# EAGLE design ServoController (EAGLE 7.6.0)
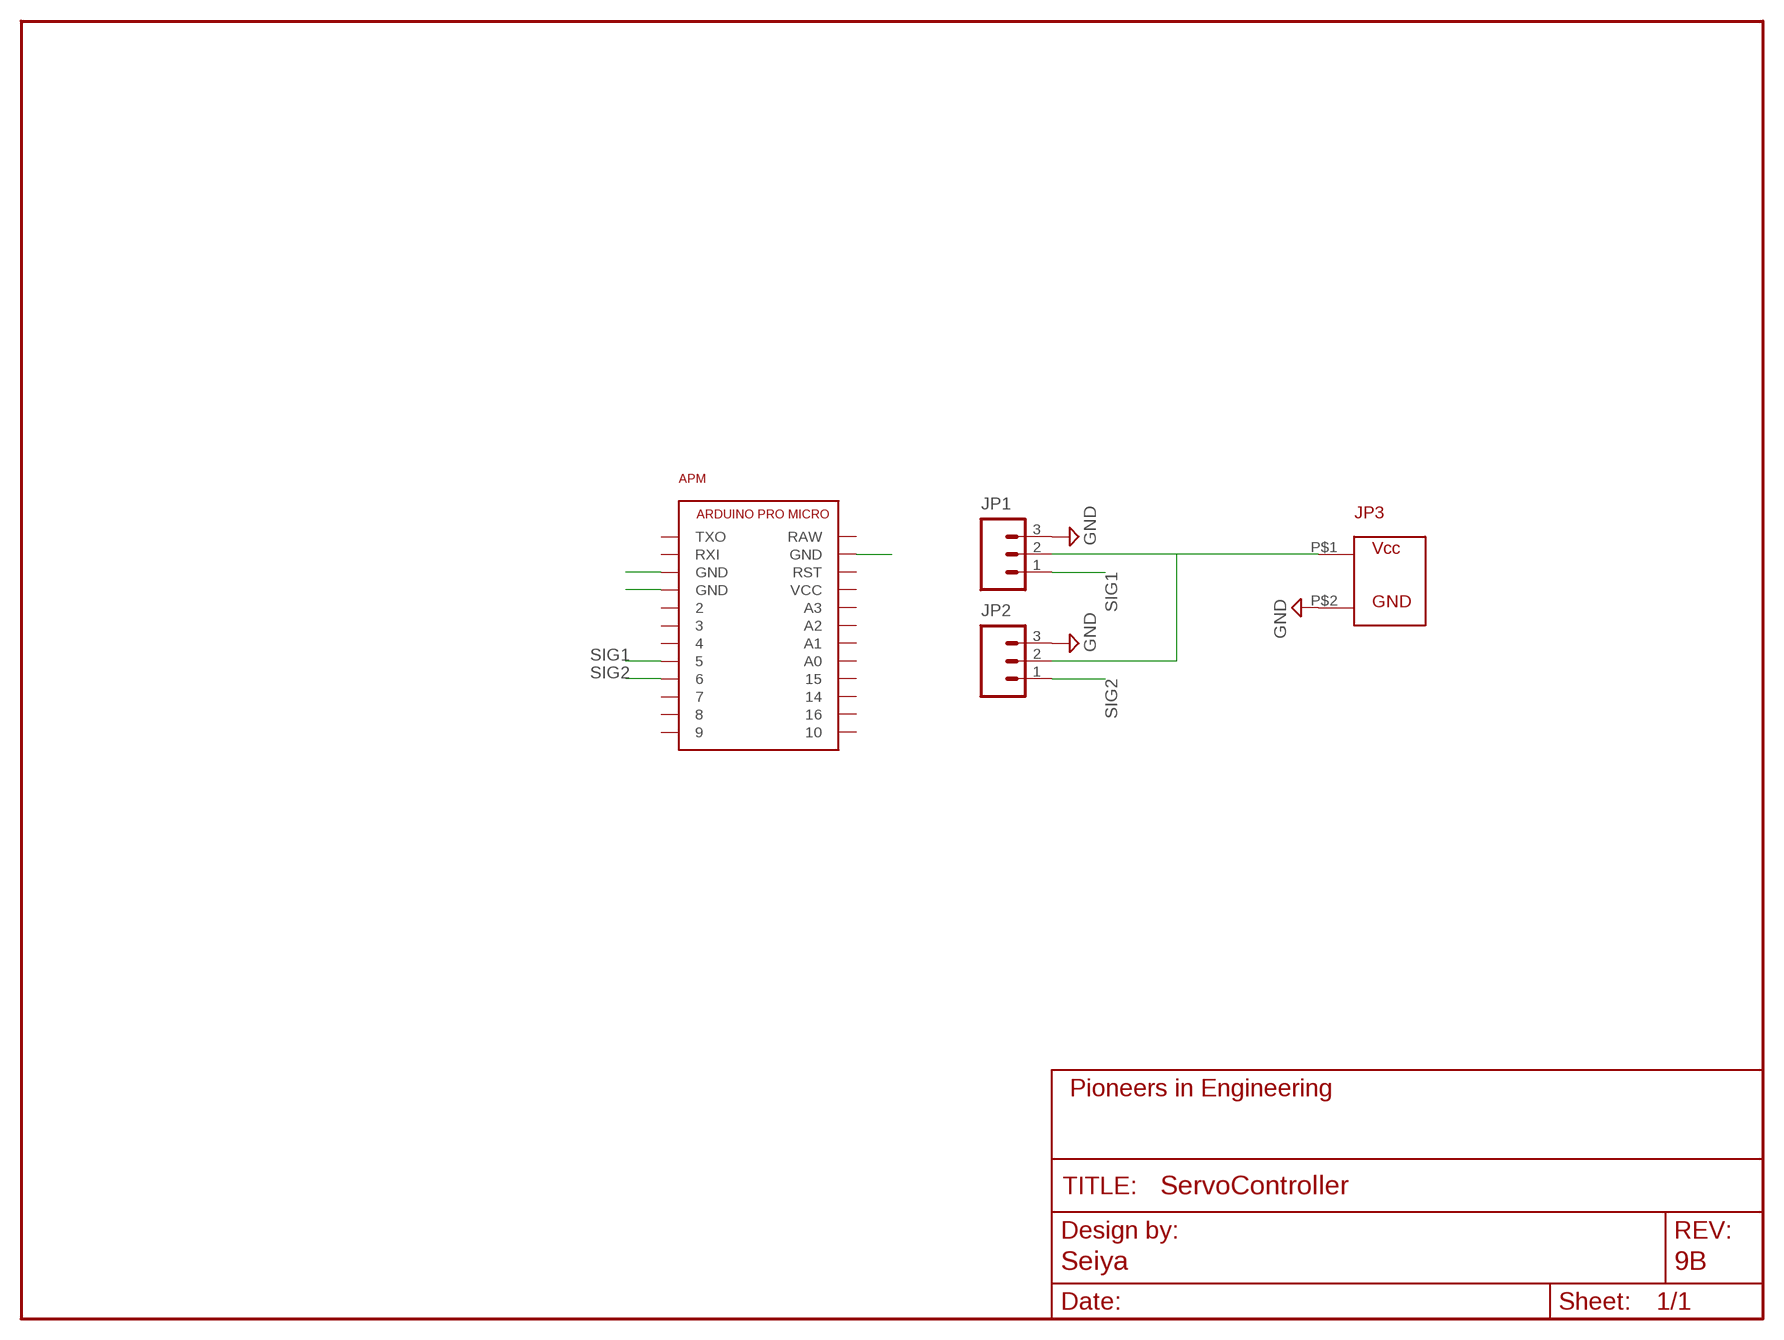
[diagram p0: schematic, sheet 1]
FRAME1 (FRAME_SCHEMATIC): AUTHOR: Seiya; REVISION: 9B

## Parts
APM  ARDUINO_PRO_MICRO  [ARDUINO_PRO_MICRO]
JP1  M031X03-MTA  [1X03-MTA]
JP2  M031X03-MTA  [1X03-MTA]
JP3  ATX  [ATX]

## Nets
GND: APM.GND@0(GND) APM.GND@1(GND) APM.GND@2(GND) JP1.3 JP2.3 JP3.P$2
SIG1: APM.5 JP1.1
SIG2: APM.6 JP2.1
VCC: JP1.2 JP2.2 JP3.P$1
Unconnected: APM.2 APM.3 APM.4 APM.7 APM.8 APM.9 APM.10 APM.14 APM.15 APM.16 APM.A0 APM.A1 APM.A2 APM.A3 APM.RAW APM.RST APM.RXI APM.TXO APM.VCC

## Library data of the parts
APM = pie:ARDUINO_PRO_MICRO: Arduino Pro Micro Electrical System Year 9's Smart Sensor Core Pin Outs <https://cdn.sparkfun.com/assets/9/c/3/c/4/523a1765757b7f5c6e8b4567.png> Buy Here <http://www.aliexpress.com/item/Mini-Leonardo-Pro-Micro-ATmega32U4-5V-16MHz-Module-For-Arduino-Best-Quality/32284746884.html?ws_ab_test=searchweb201556_8,searchweb201602_2_10057_10056_10065_10055_10054_10067_10069_10059_10058_10017_10070_10060_10061_10052_10062_10053_10050_10051,searchweb201603_1&btsid=45993952-29ca-4de4-a0fb-c7fb72b8e1a5>
JP1 JP2 = pie:M03: 3-pin 0.1-inch header and MTA connector; PIE-INT-REF-NUM: MTA
JP3 = pie:ATX: ATX 2 Pin Connector Crimper: http://www.digikey.com/product-detail/en/molex-llc/0640160204/WM17553-ND/2074099 Housing: http://www.digikey.com/product-detail/en/molex-llc/0019092029/WM4382-ND/2421313 Housing (alternative): http://www.digikey.com/product-detail/en/molex-llc/0015311026/WM1041-ND/313614 Connector: http://www.digikey.com/product-detail/en/molex-llc/0019091029/WM1602-ND/26354 Male crimps: http://www.digikey.com/product-detail/en/molex-llc/0002092103/WM1100-ND/26384 Female crimps: http://www.digikey.com/product-detail/en/molex-llc/0002091104/WM1101-ND/26386

## Board
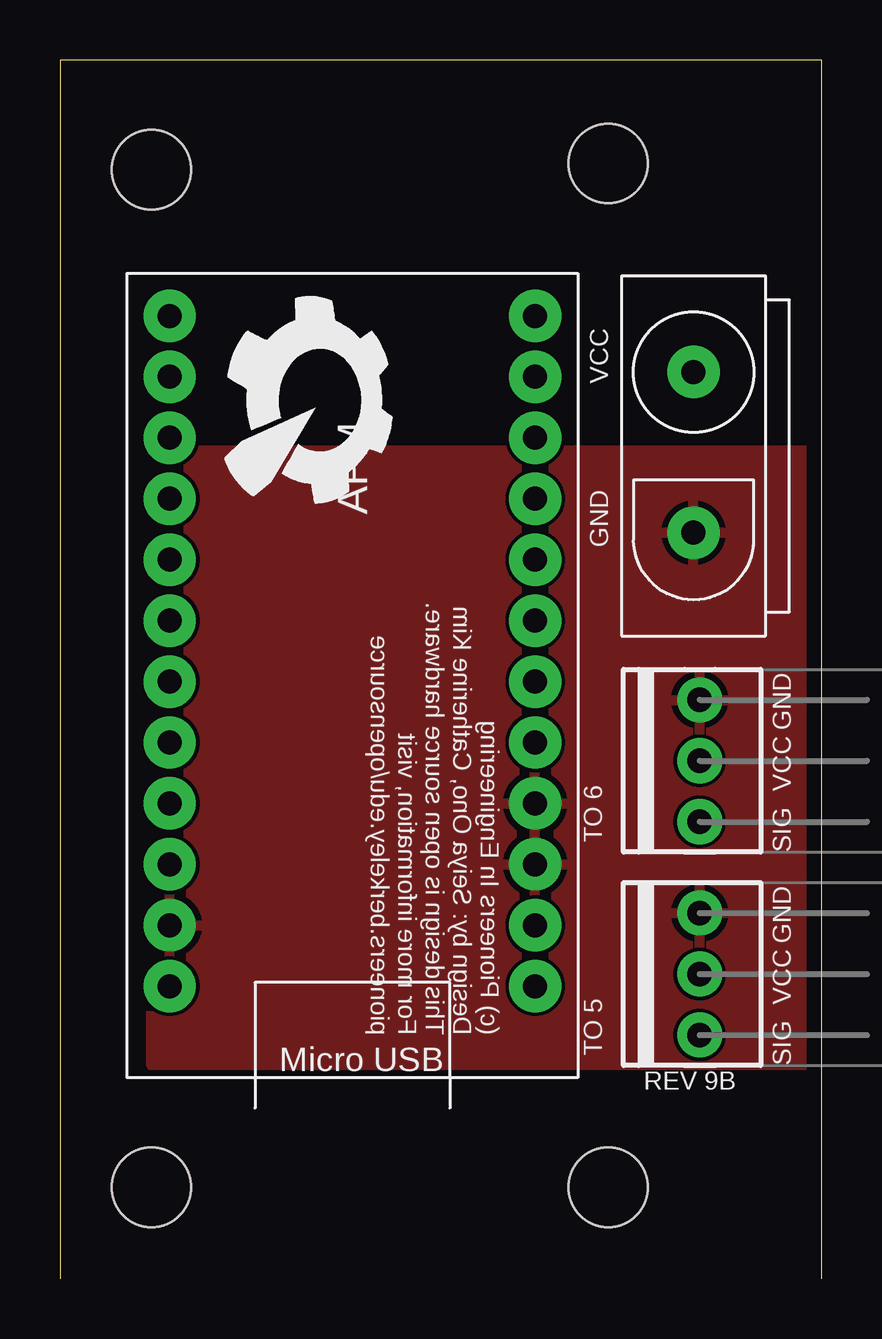
[diagram p1: board, top side]
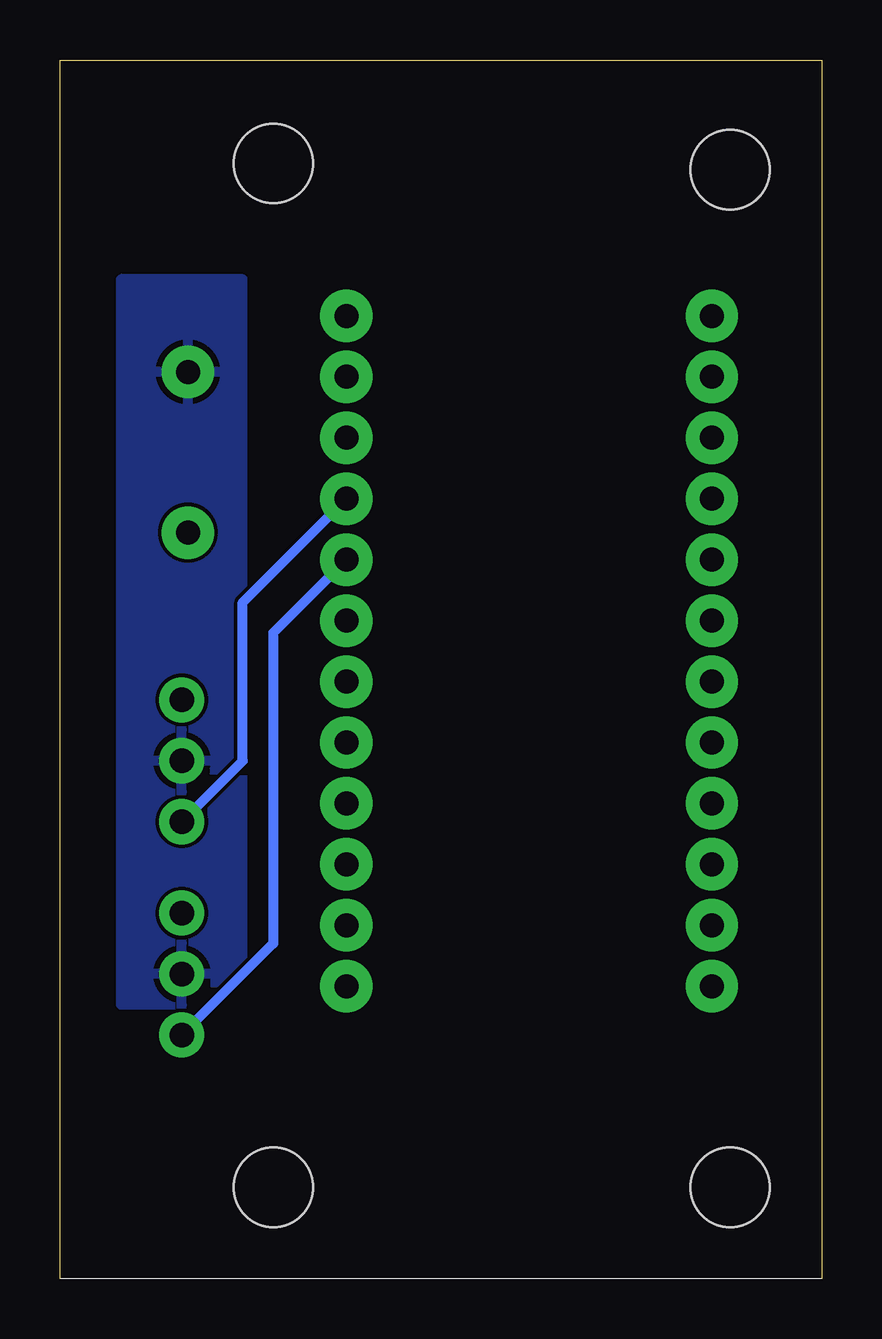
[diagram p2: board, bottom side, seen from below]

Size 31.75 x 50.8 mm. Coordinates in mm from the lower left corner, seen from the top.
Outline: 31.75,0 31.75,50.8 0,50.8 0,0
Copper layers (1*16): Top 2mil / dielectric 9mil / Bottom 2mil
Design rules "pie": minimum track width 6mil, minimum drill 15mil, track to track 6mil, track to pad 6mil, pad to pad 6mil, via to via 6mil, smd to smd 6mil, copper to edge 25mil, drill to drill 7mil, minimum pad ring 7mil, minimum via ring 7mil, stop-mask expansion 3mil, vias tented up to drill 21mil, thermal gap 10mil

### Footprints (pad centres in the part's own frame; a part is rotated, then mirrored left to right if it is on the bottom)
ARDUINO_PRO_MICRO = drill 1 pad 2.184: 2 1.778,19.558; 3 1.778,17.018; 4 1.778,14.478; 5 1.778,11.938; 6 1.778,9.398; 7 1.778,6.858; 8 1.778,4.318; 9 1.778,1.778; 10 17.018,1.778; 14 17.018,6.858; 15 17.018,9.398; 16 17.018,4.318; A0 17.018,11.938; A1 17.018,14.478; A2 17.018,17.018; A3 17.018,19.558; GND@0 1.778,24.638; GND@1 1.778,22.098; GND@2 17.018,27.178; RAW 17.018,29.718; RST 17.018,24.638; RXI 1.778,27.178; TXO 1.778,29.718; VCC 17.018,22.098
1X03-MTA = drill 1.016 pad 1.88: 1 -2.54,0; 2 0,0; 3 2.54,0
ATX = drill 1 pad 2.184: P$1 -3,0; P$2 3.7,0
STAND-OFF = hole 3.302: 0,0

### Placement (x,y rotation side)
APM  21.59,41.91 180 top
JP1  26.67,12.7 90 top
JP2  26.67,21.59 90 top
JP3  26.42,34.8 270 top
U$1  [STAND-OFF]  22.86,46.48 0 top
U$2  [PIE-LOGO-SMALL]  10.67,36.32 270 top
U$3  [STAND-OFF]  3.81,3.81 0 top
U$4  [STAND-OFF]  3.81,46.23 0 top
U$5  [STAND-OFF]  22.86,3.81 0 top

### Tracks (layer width: path | path; a pad name or v marks a point on that pad's centre or on a via)
GND
  pour Top: 3.81,34.54 31.75,34.54 31.75,8.89 3.81,8.89
SIG1
  Bottom 0.406: APM.5 22.86,26.92 22.86,13.97 JP1.1
SIG2
  Bottom 0.406: APM.6 24.13,28.19 24.13,21.59 JP2.1
VCC
  pour Bottom: 24.13,41.66 29.21,41.66 29.21,11.43 24.13,11.43

### Text on the board
tPlace: VCC | GND
tNames: GND | TO 6 | VCC | SIG | GND | TO 5 | VCC | (c) Pioneers In Engineering / Design by: Seiya Ono, Catherine Kim / This design is open source hardware. / For more information, visit / pioneers.berkeley.edu/opensource | REV 9B | SIG